# EAGLE schematic untitled3 (EAGLE 6.6.0)
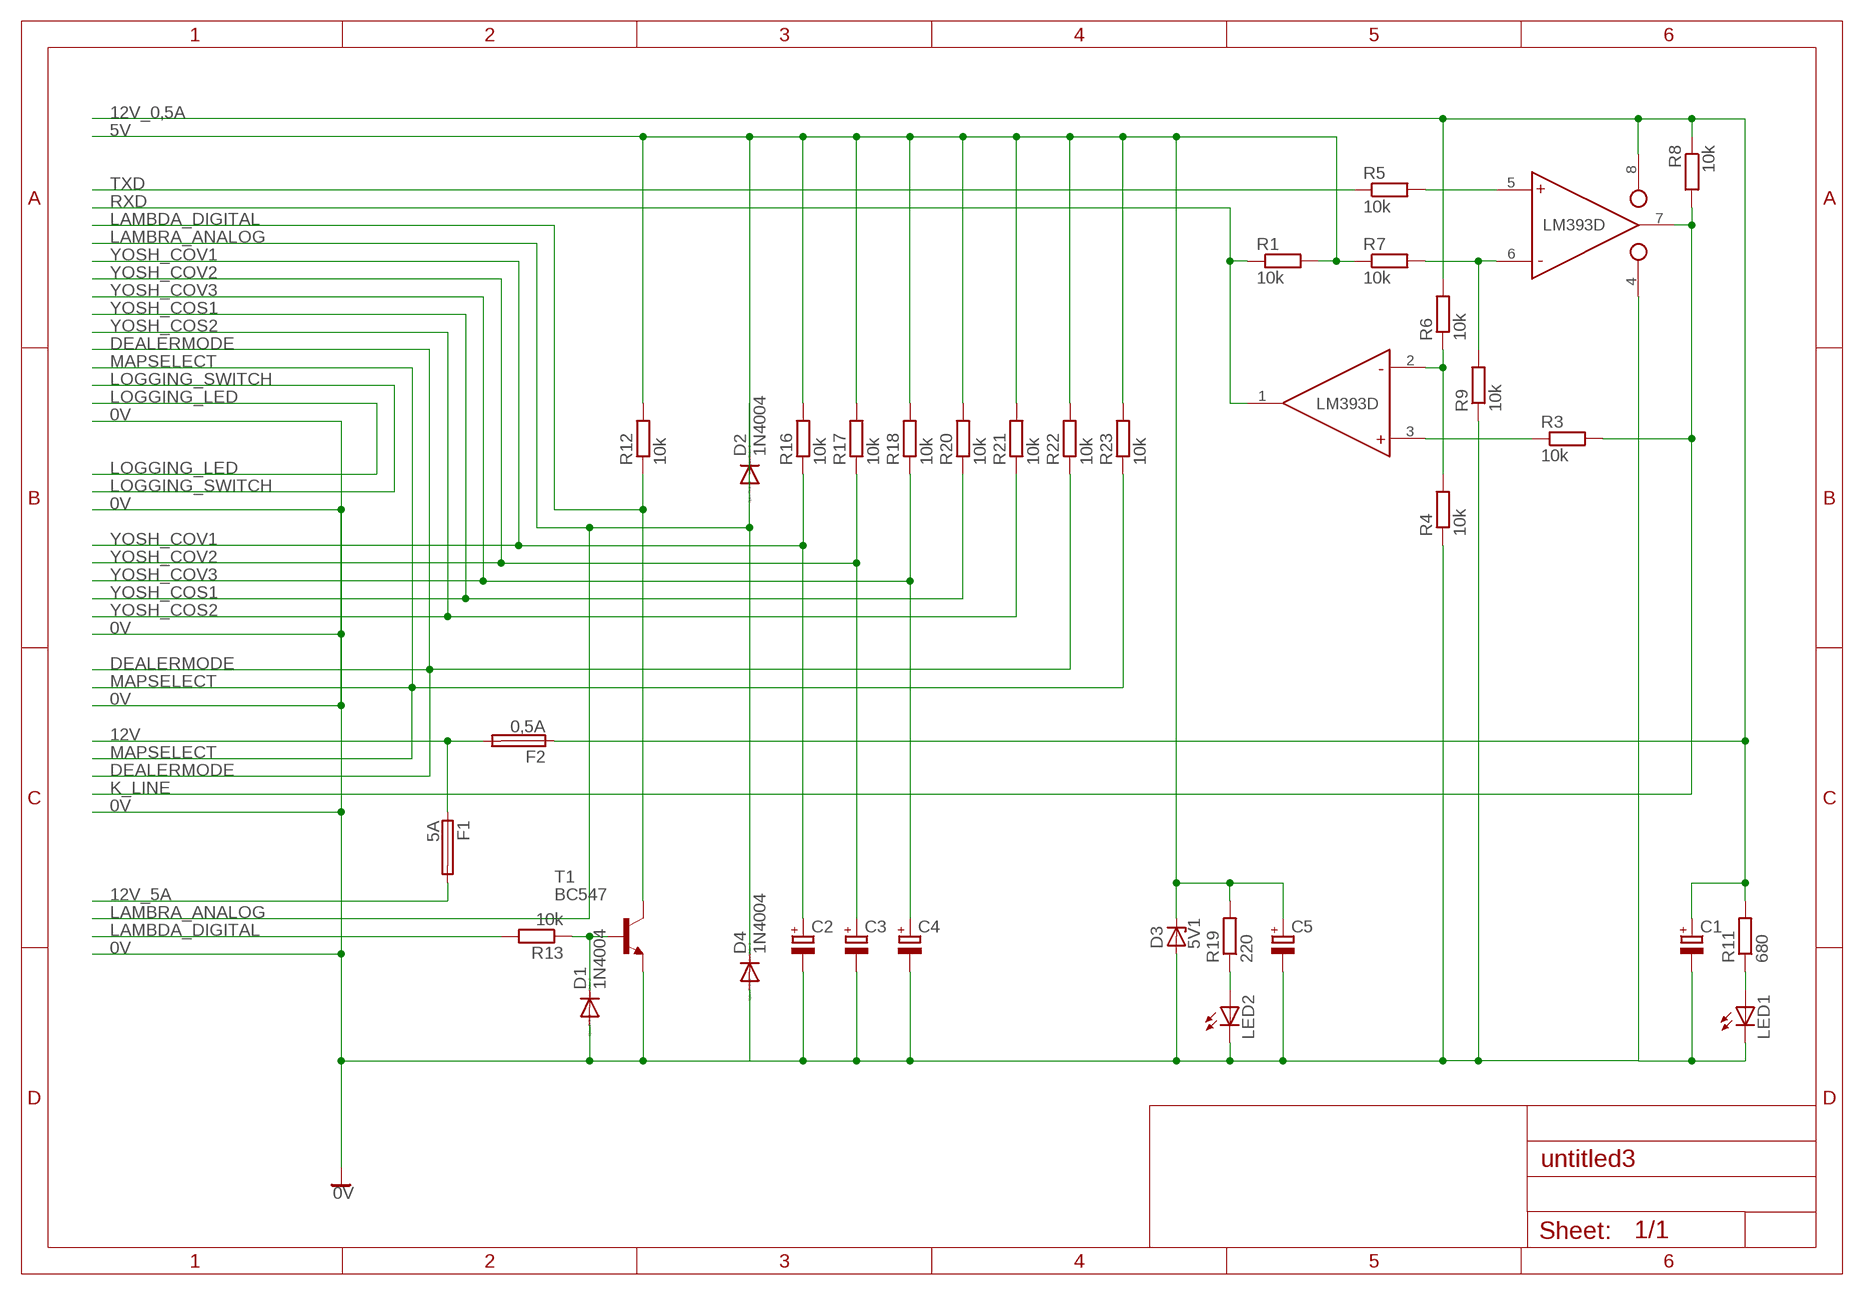
[diagram p0: schematic, sheet 1]

## Parts
C1  CPOL-EUE1.8-4  [E1,8-4]
C2  CPOL-EUE1.8-4  [E1,8-4]
C3  CPOL-EUE1.8-4  [E1,8-4]
C4  CPOL-EUE1.8-4  [E1,8-4]
C5  CPOL-EUE1.8-4  [E1,8-4]
D1  1N4004  [DO41-10]
D2  1N4004  [DO41-10]
D3  5V1  ZENER-DIODEDO34-7  [DO34Z7]
D4  1N4004  [DO41-10]
F1  5A  SH22,5  [SH22,5]
F2  0,5A  SH22,5  [SH22,5]
LED1  LED5MM  [LED5MM]
LED2  LED5MM  [LED5MM]
R1  10k  R-EU_0207/7  [0207/7]
R3  10k  R-EU_0207/7  [0207/7]
R4  10k  R-EU_0207/7  [0207/7]
R5  10k  R-EU_0207/7  [0207/7]
R6  10k  R-EU_0207/7  [0207/7]
R7  10k  R-EU_0207/7  [0207/7]
R8  10k  R-EU_0207/7  [0207/7]
R9  10k  R-EU_0207/7  [0207/7]
R11  680  R-EU_0207/7  [0207/7]
R12  10k  R-EU_0207/7  [0207/7]
R13  10k  R-EU_0207/7  [0207/7]
R16  10k  R-EU_0207/7  [0207/7]
R17  10k  R-EU_0207/7  [0207/7]
R18  10k  R-EU_0207/7  [0207/7]
R19  220  R-EU_0207/7  [0207/7]
R20  10k  R-EU_0207/7  [0207/7]
R21  10k  R-EU_0207/7  [0207/7]
R22  10k  R-EU_0207/7  [0207/7]
R23  10k  R-EU_0207/7  [0207/7]
T1  BC547  [TO92]
U$1  LM393D  [LM393D]

## Nets
0V: C1.- C2.- C3.- C4.- C5.- D1.A D3.A D4.A LED1.K(C) LED2.K(C) R4.1 R9.1 T1.1(E) U$1.4(GND)
5V: C5.+ D2.C D3.C R1.2 R7.1 R12.2 R16.2 R17.2 R18.2 R19.2 R20.2 R21.2 R22.2 R23.2
12V: F1.1 F2.2
12V_0,5A: C1.+ F2.1 R6.2 R8.1 R11.2 U$1.8(VCC)
12V_5A: F1.2
DEALERMODE: R22.1
K_LINE: R3.2 R8.2 U$1.7(OUT)
LAMBDA_DIGITAL: R12.1 R13.2 T1.3(C)
LAMBRA_ANALOG: D2.A D4.C
MAPSELECT: R23.1
N$1: LED1.A R11.1
N$6: R3.1 U$1.3(IN+)
N$7: R4.2 R6.1 U$1.2(IN-)
N$9: R5.2 U$1.5(IN+)
N$10: D1.C R13.1 T1.2(B)
N$11: R7.2 R9.2 U$1.6(IN-)
N$13: LED2.A R19.1
RXD: R1.1 U$1.1(OUT)
TXD: R5.1
YOSH_COS1: R20.1
YOSH_COS2: R21.1
YOSH_COV1: C2.+ R16.1
YOSH_COV2: C3.+ R17.1
YOSH_COV3: C4.+ R18.1

## Library data of the parts
C1-C5 = rcl:CPOL-EU: POLARIZED CAPACITOR, European symbol
D1 D2 D4 = diode:1N4004: DIODE general purpose rectifier, 1 A
D3 = diode:ZENER-DIODE: Z-Diode
F1 F2 = fuse:SH22,5: FUSE HOLDER grid 22,5 mm, OGN0031 8201, Schurter (Buerklin); MF: SCHURTER; MPN: 0031.8201; OC_FARNELL: 1162740; OC_NEWARK: 96F8317
LED1 LED2 = led:LED: LED OSRAM: - CHIPLED LG R971, LG N971, LY N971, LG Q971, LY Q971, LO R971, LY R971 LH N974, LH R974 LS Q976, LO Q976, LY Q976 LO Q996 - Hyper CHIPLED LW Q18S LB Q993, LB Q99A, LB R99A - SideLED LS A670, LO A670, LY A670, LG A670, LP A670 LB A673, LV A673, LT A673, LW A673 LH A674 LY A675 LS A676, LA A676, LO A676, LY A676, LW A676 LS A679, LY A679, LG A679 - Hyper Micro SIDELED® LS Y876, LA Y876, LO Y876, LY Y876 LT Y87S - SmartLED LW L88C, LW L88S LB L89C, LB L89S, LG L890 LS L89K, LO L89K, LY L89K LS L896, LA L896, LO L896, LY L896 - TOPLED LS T670, LO T670, LY T670, LG T670, LP T670 LSG T670, LSP T670, LSY T670, LOP T670, LYG T670 LG T671, LOG T671, LSG T671 LB T673, LV T673, LT T673, LW T673 LH T674 LS T676, LA T676, LO T676, LY T676, LB T676, LH T676, LSB T676, LW T676 LB T67C, LV T67C, LT T67C, LS T67K, LO T67K, LY T67K, LW E67C LS E67B, LA E67B, LO E67B, LY E67B, LB E67C, LV E67C, LT E67C LW T67C LS T679, LY T679, LG T679 LS T770, LO T770, LY T770, LG T770, LP T770 LB T773, LV T773, LT T773, LW T773 LH T774 LS E675, LA E675, LY E675, LS T675 LS T776, LA T776, LO T776, LY T776, LB T776 LHGB T686 LT T68C, LB T68C - Hyper Mini TOPLED® LB M676 - Mini TOPLED Santana® LG M470 LS M47K, LO M47K, LY M47K Source: http://www.osram.convergy.de LUXEON: - LUMILED® LXK2-PW12-R00, LXK2-PW12-S00, LXK2-PW14-U00, LXK2-PW14-V00 LXK2-PM12-R00, LXK2-PM12-S00, LXK2-PM14-U00 LXK2-PE12-Q00, LXK2-PE12-R00, LXK2-PE12-S00, LXK2-PE14-T00, LXK2-PE14-U00 LXK2-PB12-K00, LXK2-PB12-L00, LXK2-PB12-M00, LXK2-PB14-N00, LXK2-PB14-P00, LXK2-PB14-Q00 LXK2-PR12-L00, LXK2-PR12-M00, LXK2-PR14-Q00, LXK2-PR14-R00 LXK2-PD12-Q00, LXK2-PD12-R00, LXK2-PD12-S00 LXK2-PH12-R00, LXK2-PH12-S00 LXK2-PL12-P00, LXK2-PL12-Q00, LXK2-PL12-R00 Source: www.luxeon.com KINGBRIGHT: KA-3528ASYC Source: www.kingbright.com
R1 R3-R9 R11-R13 R16-R23 = rcl:R-EU_: RESISTOR, European symbol
T1 = transistor:BC547: NPN TRANSISTOR
U$1 = lm393d:LM393D